# Altium schematic sheet E_CAT.SchDoc
size 431 x 279 mm; SheetNumber: 3; PageSetup: Record=PageOptions|CenterHorizontal=True|CenterVertical=True|PrintScale=0.96|XCorrection=1.00|YCorrection=1.00|PrintKind=1|BorderSize=5000000|LeftOffset=0|BottomOffset=0|Orientation=2|PaperLength=1000|PaperWidth=1000|Scale=100|PaperSource=258|PrintQuality=600|MediaType=1|DitherType=10|PaperKind=11x17|PrintScaleMode=1; CopyrightDate: 20xx
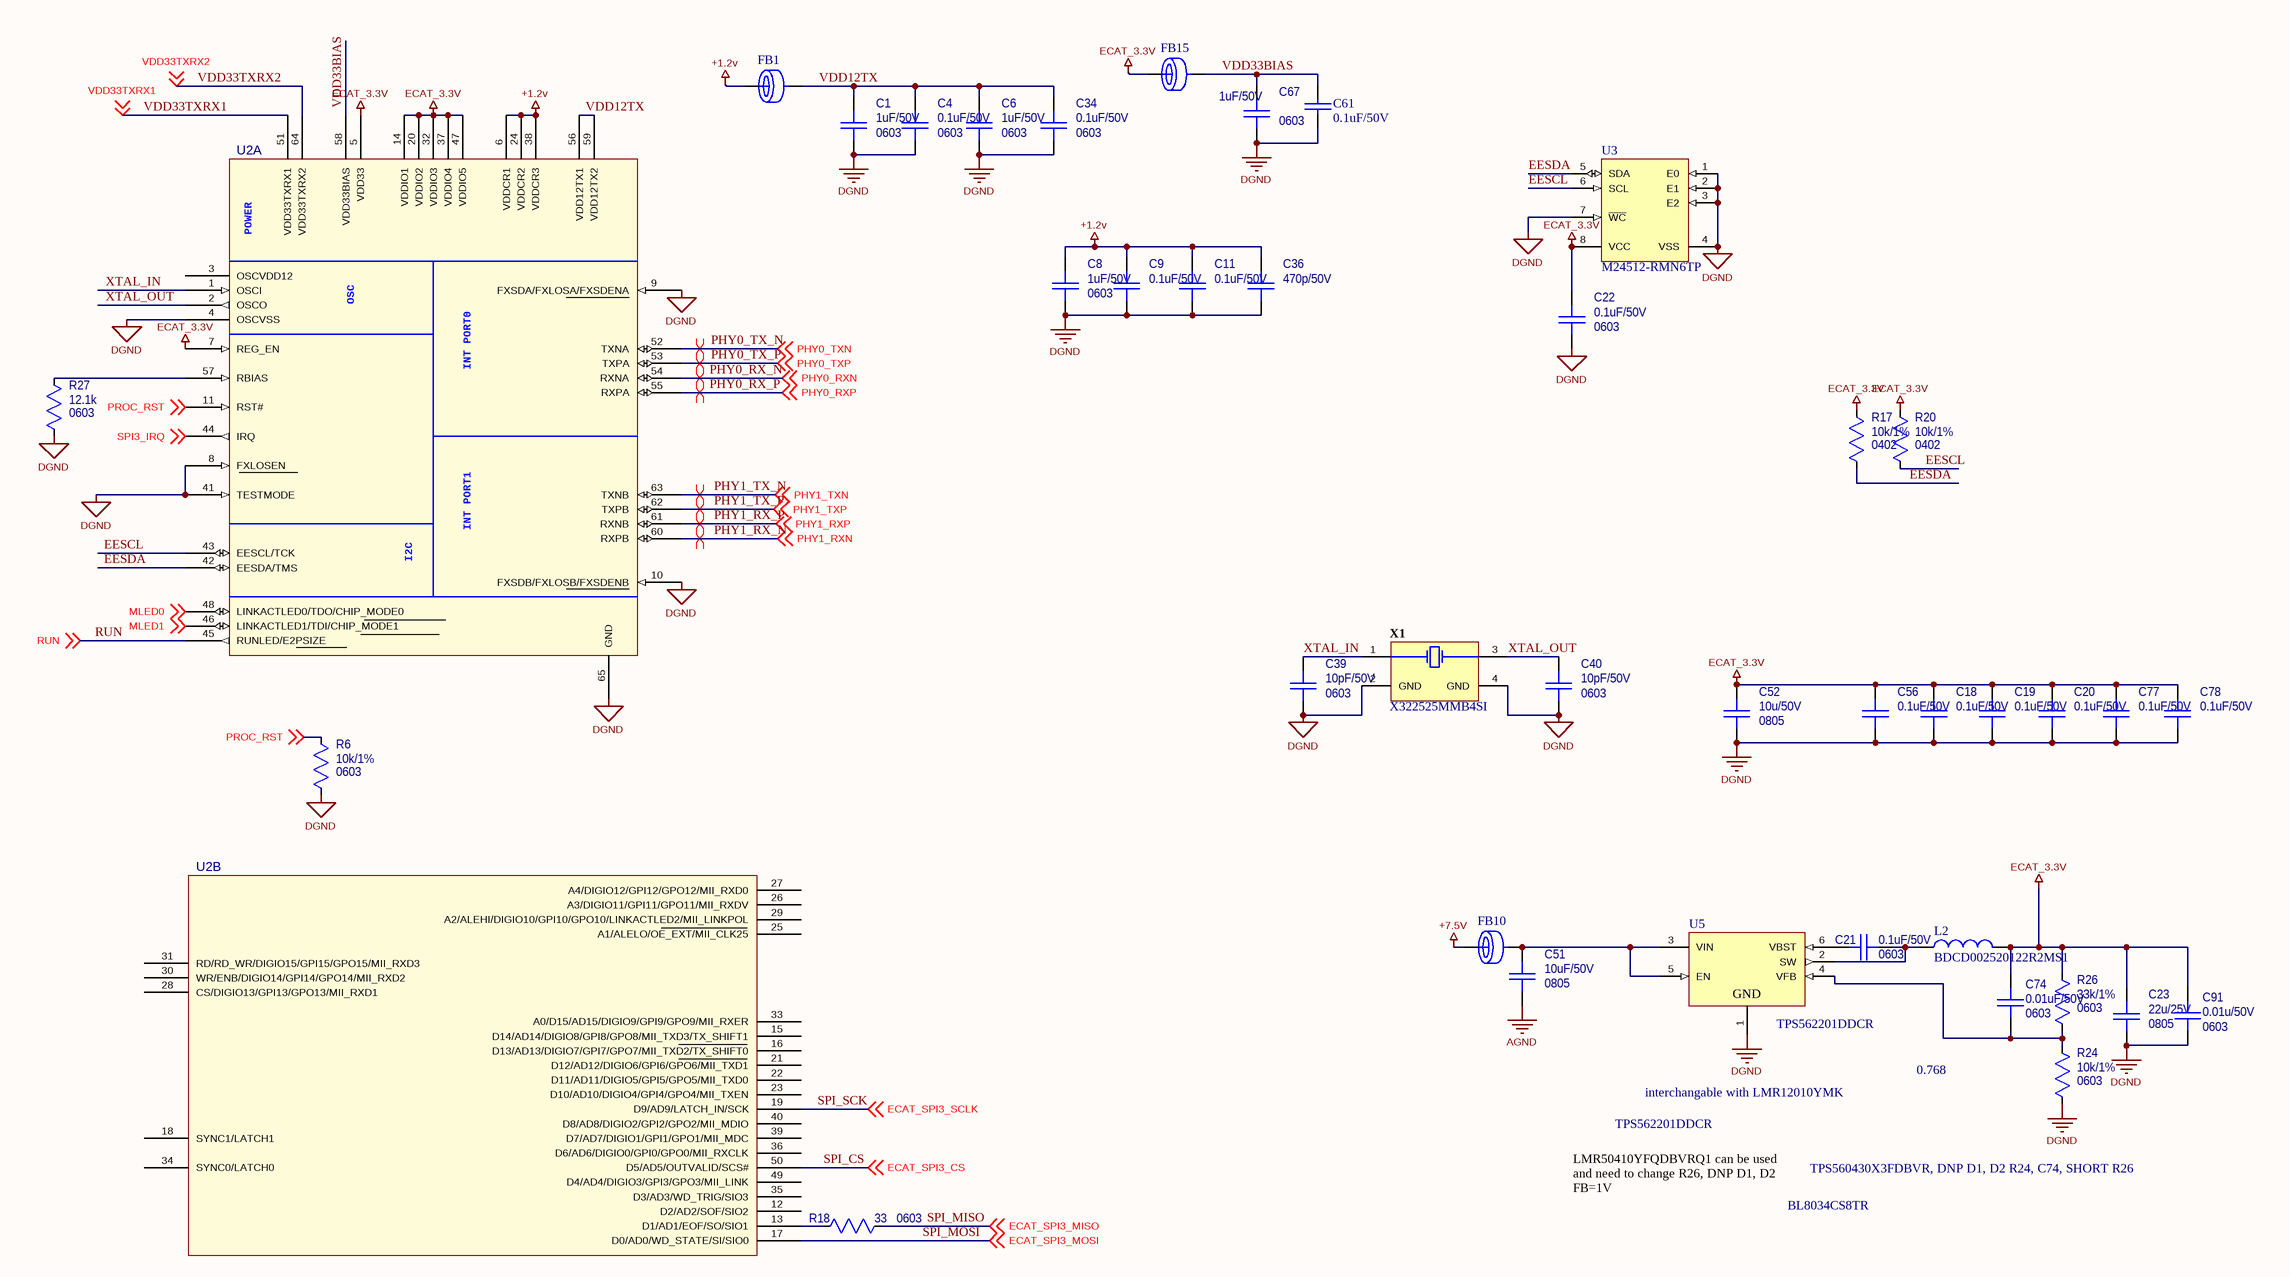
[diagram p0: E_CAT.SchDoc]

## Parts
C1  Package: 0603  [CAPC1608X092N_0603]  (hidden comment: 1uF/50V)
C4  Package: 0603  [CAPC1608X092N_0603]  (hidden comment: 0.1uF/50V)
C6  Package: 0603  [CAPC1608X092N_0603]  (hidden comment: 1uF/50V)
C8  Package: 0603  [CAPC1608X092N_0603]  (hidden comment: 1uF/50V)
C9  0.1uF/50V  [CAPC1608X092N_0603]
C11  0.1uF/50V  [CAPC1608X092N_0603]
C18  0.1uF/50V  [CAPC1608X092N_0603]
C19  0.1uF/50V  [CAPC1608X092N_0603]
C20  0.1uF/50V  [CAPC1608X092N_0603]
C21  Package: 0603  [CAPC1608X092N_0603]  (hidden comment: 0.1uF/50V)
C22  Package: 0603  [CAPC1608X092N_0603]  (hidden comment: 0.1uF/50V)
C23  Package: 0805  [CAPC2012X127N_0805]  (hidden comment: 22u/25V)
C34  Package: 0603  [CAPC1608X092N_0603]  (hidden comment: 0.1uF/50V)
C36  470p/50V  [CAPC1608X092N_0603]
C39  Package: 0603  [CAPC1608X092N_0603]  (hidden comment: 10pF/50V)
C40  Package: 0603  [CAPC1608X092N_0603]  (hidden comment: 10pF/50V)
C51  Package: 0805  [CAPC2012X127N_0805]  (hidden comment: 10uF/50V)
C52  Package: 0805  [CAPC2012X127N_0805]  (hidden comment: 10u/50V)
C56  0.1uF/50V  [CAPC1608X092N_0603]
C61  0.1uF/50V  [CAPC1608X092N_0603]
C67  Package: 0603  [CAPC1608X092N_0603]  (hidden comment: 1uF/50V)
C74  Package: 0603  [CAPC1608X092N_0603]  (hidden comment: 0.01uF/50V)
C77  0.1uF/50V  [CAPC1608X092N_0603]
C78  0.1uF/50V  [CAPC1608X092N_0603]
C91  Package: 0603  [CAPC1608X092N_0603]  (hidden comment: 0.01u/50V)
FB1  FBC0603  [FBC0603]  (value not drawn)
FB10  FBC0603  [FBC0603]  (value not drawn)
FB15  FBC0603  [FBC0603]  (value not drawn)
L2  BDCD002520122R2MS1  [PULS-BDCD00252012_V]
R6  Package: 0603  [RESC1608X055N_0603]  (hidden comment: 10k/1%)
R17  Package: 0402  [RESC1005X040N_0402]  (hidden comment: 10k/1%)
R18  Package: 0603  [RESC1608X055N_0603]  (hidden comment: 33)
R20  Package: 0402  [RESC1005X040N_0402]  (hidden comment: 10k/1%)
R24  Package: 0603  [RESC1608X055N_0603]  (hidden comment: 10k/1%)
R26  Package: 0603  [RESC1608X055N_0603]  (hidden comment: 33k/1%)
R27  Package: 0603  [RESC1608X055N_0603]  (hidden comment: 12.1k)
U2  LAN9252  [MCHP-QFN-64-6000x6000TP_V]  (value not drawn)  (parts A,B of 2)
U3  M24512-RMN6TP  [STM-SO8N_L]
U5  TPS562201DDCR  [DDC0006A_L]
X1  X322525MMB4SI  [TXC-7M-4_V]

## Nets
+1.2v: C8.1 C9.1 C11.1 C36.1 FB1.1 U2.6(VDDCR1) U2.24(VDDCR2) U2.38(VDDCR3)
+7.5V: FB10.1
AGND: C51.2
DGND: C1.2 C4.2 C6.2 C8.2 C9.2 C11.2 C18.2 C19.2 C20.2 C22.2 C23.2 C34.2 C36.2 C39.2 C40.2 C52.2 C56.2 C61.1 C67.2 C77.2 C78.2 C91.2 R6.1 R24.1 R27.1 U2.4(OSCVSS) U2.8(FXLOSEN) U2.9(FXSDA/FXLOSA/FXSDENA) U2.10(FXSDB/FXLOSB/FXSDENB) U2.41(TESTMODE) U2.65(GND) U3.1(E0) U3.2(E1) U3.3(E2) U3.4(VSS) U3.7(~{WC}) U5.1(GND) X1.2(GND) X1.4(GND)
ECAT_3.3V: C18.1 C19.1 C20.1 C22.1 C23.1 C52.1 C56.1 C74.1 C77.1 C78.1 C91.1 FB15.1 L2.2 R17.2 R20.2 R26.2 U2.5(VDD33) U2.7(REG_EN) U2.14(VDDIO1) U2.20(VDDIO2) U2.32(VDDIO3) U2.37(VDDIO4) U2.47(VDDIO5) U3.8(VCC)
EESCL: R20.1 U2.43(EESCL/TCK) U3.6(SCL)
EESDA: R17.1 U2.42(EESDA/TMS) U3.5(SDA)
MLED0: U2.48(LINKACTLED0/TDO/CHIP_MODE0) ; off-sheet MLED0
MLED1: U2.46(LINKACTLED1/TDI/CHIP_MODE1) ; off-sheet MLED1
PHY0_RX_N: U2.54(RXNA) ; off-sheet PHY0_RXN  [also labelled PHY0_RXN]
PHY0_RX_P: U2.55(RXPA) ; off-sheet PHY0_RXP  [also labelled PHY0_RXP]
PHY0_TX_N: U2.52(TXNA) ; off-sheet PHY0_TXN  [also labelled PHY0_TXN]
PHY0_TX_P: U2.53(TXPA) ; off-sheet PHY0_TXP  [also labelled PHY0_TXP]
PHY1_RX_N: U2.60(RXPB) ; off-sheet PHY1_RXN  [also labelled PHY1_RXN]
PHY1_RX_P: U2.61(RXNB) ; off-sheet PHY1_RXP  [also labelled PHY1_RXP]
PHY1_TX_N: U2.63(TXNB) ; off-sheet PHY1_TXN  [also labelled PHY1_TXN]
PHY1_TX_P: U2.62(TXPB) ; off-sheet PHY1_TXP  [also labelled PHY1_TXP]
PROC_RST: R6.2 U2.11(RST#) ; off-sheet PROC_RST
RUN: U2.45(RUNLED/E2PSIZE) ; off-sheet RUN
SPI3_IRQ: U2.44(IRQ) ; off-sheet SPI3_IRQ
SPI_CS: U2.50(D5/AD5/OUTVALID/SCS#) ; off-sheet ECAT_SPI3_CS  [also labelled ECAT_SPI3_CS]
SPI_MISO: R18.1 ; off-sheet ECAT_SPI3_MISO  [also labelled ECAT_SPI3_MISO]
SPI_MOSI: U2.17(D0/AD0/WD_STATE/SI/SIO0) ; off-sheet ECAT_SPI3_MOSI  [also labelled ECAT_SPI3_MOSI]
SPI_SCK: U2.19(D9/AD9/LATCH_IN/SCK) ; off-sheet ECAT_SPI3_SCLK  [also labelled ECAT_SPI3_SCLK]
VDD12TX: C1.1 C4.1 C6.1 C34.1 FB1.2 U2.56(VDD12TX1) U2.59(VDD12TX2)
VDD33BIAS: C61.2 C67.1 FB15.2 U2.58(VDD33BIAS)
VDD33TXRX1: U2.51(VDD33TXRX1) ; off-sheet VDD33TXRX1
VDD33TXRX2: U2.64(VDD33TXRX2) ; off-sheet VDD33TXRX2
XTAL_IN: C39.1 U2.1(OSCI) X1.1(X1)
XTAL_OUT: C40.1 U2.2(OSCO) X1.3(X2)
NetC21_1: C21.1 U5.6(VBST)
NetC21_2: C21.2 L2.1 U5.2(SW)
NetC51_1: C51.1 FB10.2 U5.3(VIN) U5.5(EN)
NetC74_2: C74.2 R24.2 R26.1 U5.4(VFB)
NetR18_2: R18.2 U2.13(D1/AD1/EOF/SO/SIO1)
NetR27_2: R27.2 U2.57(RBIAS)

Not connected (* = marked no-connect by the designer): U2 3(OSCVDD12) 12(D2/AD2/SOF/SIO2) 15(D14/AD14/DIGIO8/GPI8/GPO8/MII_TXD3/TX_SHIFT1) 16(D13/AD13/DIGIO7/GPI7/GPO7/MII_TXD2/TX_SHIFT0) 18(SYNC1/LATCH1) 21(D12/AD12/DIGIO6/GPI6/GPO6/MII_TXD1) 22(D11/AD11/DIGIO5/GPI5/GPO5/MII_TXD0) 23(D10/AD10/DIGIO4/GPI4/GPO4/MII_TXEN) 25(A1/ALELO/OE_EXT/MII_CLK25) 26(A3/DIGIO11/GPI11/GPO11/MII_RXDV) 27(A4/DIGIO12/GPI12/GPO12/MII_RXD0) 28(CS/DIGIO13/GPI13/GPO13/MII_RXD1) 29(A2/ALEHI/DIGIO10/GPI10/GPO10/LINKACTLED2/MII_LINKPOL) 30(WR/ENB/DIGIO14/GPI14/GPO14/MII_RXD2) 31(RD/RD_WR/DIGIO15/GPI15/GPO15/MII_RXD3) 33(A0/D15/AD15/DIGIO9/GPI9/GPO9/MII_RXER) 34(SYNC0/LATCH0) 35(D3/AD3/WD_TRIG/SIO3) 36(D6/AD6/DIGIO0/GPI0/GPO0/MII_RXCLK) 39(D7/AD7/DIGIO1/GPI1/GPO1/MII_MDC) 40(D8/AD8/DIGIO2/GPI2/GPO2/MII_MDIO) 49(D4/AD4/DIGIO3/GPI3/GPO3/MII_LINK)

## Layout directives
differential pair: PHY0_RX_N, PHY0_RX_P, PHY0_TX_N, PHY0_TX_P, PHY1_RX_N, PHY1_RX_P, PHY1_TX_N, PHY1_TX_P

## Notes on the sheet
- interchangable with LMR12010YMK
- 0.768
- TPS562201DDCR
- TPS560430X3FDBVR, DNP D1, D2 R24, C74, SHORT R26
- LMR50410YFQDBVRQ1 can be used and need to change R26, DNP D1, D2
  FB=1V
- BL8034CS8TR
- DWG. TITLE
- FILE NAME:
- OrangePrecision
- DWG. NO.
- REV.
- DATE PRINTED:
- ENG.
- DWN.
- DATE
- SHEET
- OF
- (in symbol LAN9252_QFN64, part A) POWER; OSC; INT PORT0; INT PORT1; I2C

## Library data of the parts
C1 C6 C8 C67 = Capacitor_0603: PartNumber: CL10A105KB8NNNC; Tolerance: [tol]; TempCo: [tempco]; Voltage Rating: [voltage]; Supplier 1: *; Supplier Part Number 1: *; Value: 1uF/50V; SupplierDescription: CAP CER 1UF 25V X5R 0603
C4 C9 C11 C18-C20 C34 C56 C77 C78 = Capacitor_0402: PartNumber: CC0603KRX7R9BB104; Tolerance: [tol]; TempCo: [tempco]; Voltage Rating: [voltage]; Supplier 1: *; Supplier Part Number 1: *; Value: 0.1uF/50V; SupplierDescription: CAP CER 0.1UF 16V X7R 0402
  C9 C11 C18-C20 C56 C77 C78: Package: 0603
C21 C22 = Capacitor_0603: PartNumber: CC0603KRX7R9BB104; Tolerance: [tol]; TempCo: [tempco]; Voltage Rating: [voltage]; Supplier 1: *; Supplier Part Number 1: *; Value: 0.1uF/50V; SupplierDescription: CAP CER 0.1UF 50V X7R 0603
C23 = Capacitor_0805: PartNumber: CL21A226MAYNNNE; Tolerance: [tol]; TempCo: [tempco]; Voltage Rating: [voltage]; Supplier 1: *; Supplier Part Number 1: *; Value: 22u/25V; SupplierDescription: CAP CER 22UF 10V X5R 0805
C36 = Capacitor_0402: PartNumber: CC0603KRX7R9BB471; Tolerance: [tol]; TempCo: [tempco]; Voltage Rating: [voltage]; Supplier 1: *; Supplier Part Number 1: *; Package: 0603; Value: 470p/50V; SupplierDescription: CAP CER 470PF 50V X7R 0402
C39 C40 = Capacitor_0603: PartNumber: CC0603JRNPO9BN100; Tolerance: [tol]; TempCo: [tempco]; Voltage Rating: [voltage]; Supplier 1: *; Supplier Part Number 1: *; Value: 10pF/50V; SupplierDescription: CAP CER 10PF 50V C0G/NPO 0603
C51 = Capacitor_0805: PartNumber: CL21A106KBYQNNE; Tolerance: [tol]; TempCo: [tempco]; Voltage Rating: [voltage]; Power Rating: *; Value: 10uF/50V; SupplierDescription: CAP CER 10UF 10V X5R 0805
C52 = Capacitor_0603: PartNumber: GRM188R61A106KE69D; Tolerance: [tol]; TempCo: [tempco]; Voltage Rating: [voltage]; Supplier 1: *; Supplier Part Number 1: *; Value: 10u/50V; SupplierDescription: CAP CER 10UF 10V X5R 0603
C61 = CAP: PartNumber: CC0603KRX7R9BB104; Value: 0.1uF/50V; Package: 0603
C74 C91 = Capacitor_0603: PartNumber: 0603B103K500NT; Tolerance: [tol]; TempCo: [tempco]; Voltage Rating: [voltage]; Power Rating: *; SupplierDescription: CAP CER 10000PF 50V X7R 0603
  C74: Value: 0.01uF/50V
  C91: Value: 0.01u/50V
FB1 FB10 FB15 = FBC0603: PartNumber: BLM18AG601SN1D; Value: 600 Ohms @ 100MHz; SupplierDescription: FERRITE BEAD 600 OHM 0603 1LN
L2 = BDCD002520122R2MS1: Type: Wirewound; Online Catalog: VLSSeries; Tolerance: ±20%; Shielding: Shielded; Package Description: 2-Pin Surface Mount Device, Body 10 x 9.7 mm; Standard Package: 500; Package / Case: Nonstandard; Mounting Technology: SurfaceMount; Series: VLF; Operating Temperature: -40°C~105°C; Package Reference: VLS252012; Packaging: Tape&Reel(TR); Mounting Type: SurfaceMount; Value: BDCD002520122R2MS1; PartNumber: BDCD002520122R2MS1
R6 = Resistor_0402: PartNumber: RC0603FR-0710KL; Power Rating: [power]; TempCo: [tempco]; Tolerance: tol; Value: 10k/1%; SupplierDescription: RES SMD 10K OHM 1% 1/10W 0402
R17 R20 = Resistor_0402: PartNumber: MR04X1002FTL; Power Rating: [power]; TempCo: [tempco]; Tolerance: tol; Value: 10k/1%; SupplierDescription: RES SMD 10K OHM 1% 1/10W 0402
R18 = Resistor_0402: PartNumber: RC0402FR-0733RL; Power Rating: [power]; TempCo: [tempco]; Tolerance: tol; Value: 33; SupplierDescription: RES SMD 33 OHM 1% 1/16W 0402
R24 = Resistor_0603: PartNumber: RC0603FR-0710KL; Power Rating: [power]; TempCo: [tempco]; Tolerance: tol; Value: 10k/1%; SupplierDescription: RES SMD 10K OHM 1% 1/10W 0603
R26 = Resistor_0603: PartNumber: RC0603FR-0733KL; Power Rating: [power]; TempCo: [tempco]; Tolerance: tol; Value: 33k/1%; SupplierDescription: RES SMD 33K OHM 1% 1/10W 0603
R27 = Resistor_0603: PartNumber: RS-03K1212FT; Power Rating: [power]; TempCo: [tempco]; Tolerance: tol; Value: 12.1k; SupplierDescription: RES 12.1K OHM 1% 1/10W 0603
U2 = LAN9252_QFN64: Populated: Yes; Owner: Manikandan; Supplier Part Number 1: LAN9252I/ML-ND; Supplier 1: Digikey; RoHS: Yes; Package: QFN64-9X9x1; Status: New; Value: LAN9252; PartNumber: LAN9252
U3 = M24512-RMN6TP: Supply Voltage Max: 5.5V; Memory Case Style: SOIC; SVHC: NoSVHC(17-Dec-2015); Memory Size: 512Kbit; Product Range: 32KbitSerialSPIEEPROMs; Supply Voltage Min: 1.8V; No. of Pins: 8Pins; Package Description: 8-Pin Small Outline Integrated Circuit, Body 4.9 x 3.9 mm, Pitch 1.27 mm; Operating Temperature Min: -40°C; Operating Temperature Max: 85°C; Mounting Technology: SurfaceMount; Packaging: Each; Package Reference: SO8N; MSL: -; Value: M24512-RMN6TP; PartNumber: M24512-RMN6TP
U5 = TPS562201DDCR: Shielding: Unshielded; Resistance: 50 Ohm; RoHSCompliant: true; PackageDescription: 6-Pin Small Outline Transistor, Body 2.9 x 1.6 mm, Pitch 0.95 mm; Mount: Surface Mount; Min Operating Temperature: -40 degC; Pins: 5; Package Quantity: 1; Packaging: Cut Tape; Width: 1.01 mm; PackageReference: DDC0006A; Value: TPS562201DDCR; PartNumber: TPS562201DDCR
X1 = 7M-25.000MEEQ-T: Operating Mode: Fundamental; Other Names: 887-1329-1; Mounting Technology: SurfaceMount; Type: MHzCrystal; Mounting Type: SurfaceMount; Series: 7M; Package Reference: 7M-4; Size / Dimension: 0.126"Lx0.098"W(3.20mmx2.50mm); Package Description: 4-Pin Surface Mount Device, Body 3.2 x 2.5 mm; Operating Temperature: -20°C~70°C; Packaging: CutTape(CT); Standard Package: 1; Package / Case: 4-SMD,NoLead(DFN,LCC); Value: X322525MMB4SI; PartNumber: X322525MMB4SI